# EAGLE design Serqet (EAGLE 6.6.0)

## Sheet 1 of 12: Probe Input
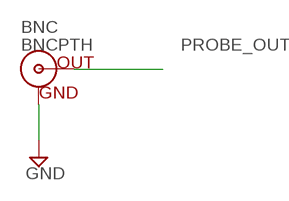
[diagram p0: schematic, sheet 1]

### Parts
BNC  BNCPTH  [BNC]

### Nets
GND: BNC.GND ; also sheet 2,3,4,5,6,7,8,9,10,11,12
PROBE_OUT: BNC.S(OUT) ; also sheet 2,3

## Sheet 2 of 12: Input Voltage Protection
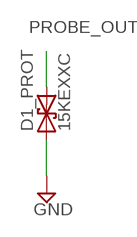
[diagram p1: schematic, sheet 2]

### Parts
D1_PROT  15KEXXC  [CB429-17]

### Nets
GND: D1_PROT.A ; also sheet 1,3,4,5,6,7,8,9,10,11,12
PROBE_OUT: D1_PROT.C ; also sheet 1,3

## Sheet 3 of 12: Attenuator
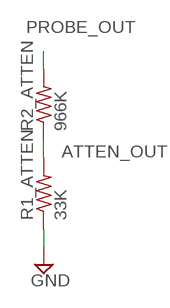
[diagram p2: schematic, sheet 3]

### Parts
R1_ATTEN  33K  R-US_R0603  [R0603]
R2_ATTEN  966K  R-US_R0603  [R0603]

### Nets
ATTEN_OUT: R1_ATTEN.2 R2_ATTEN.1 ; also sheet 4,8,11
GND: R1_ATTEN.1 ; also sheet 1,2,4,5,6,7,8,9,10,11,12
PROBE_OUT: R2_ATTEN.2 ; also sheet 1,2

## Sheet 4 of 12: DC Offset
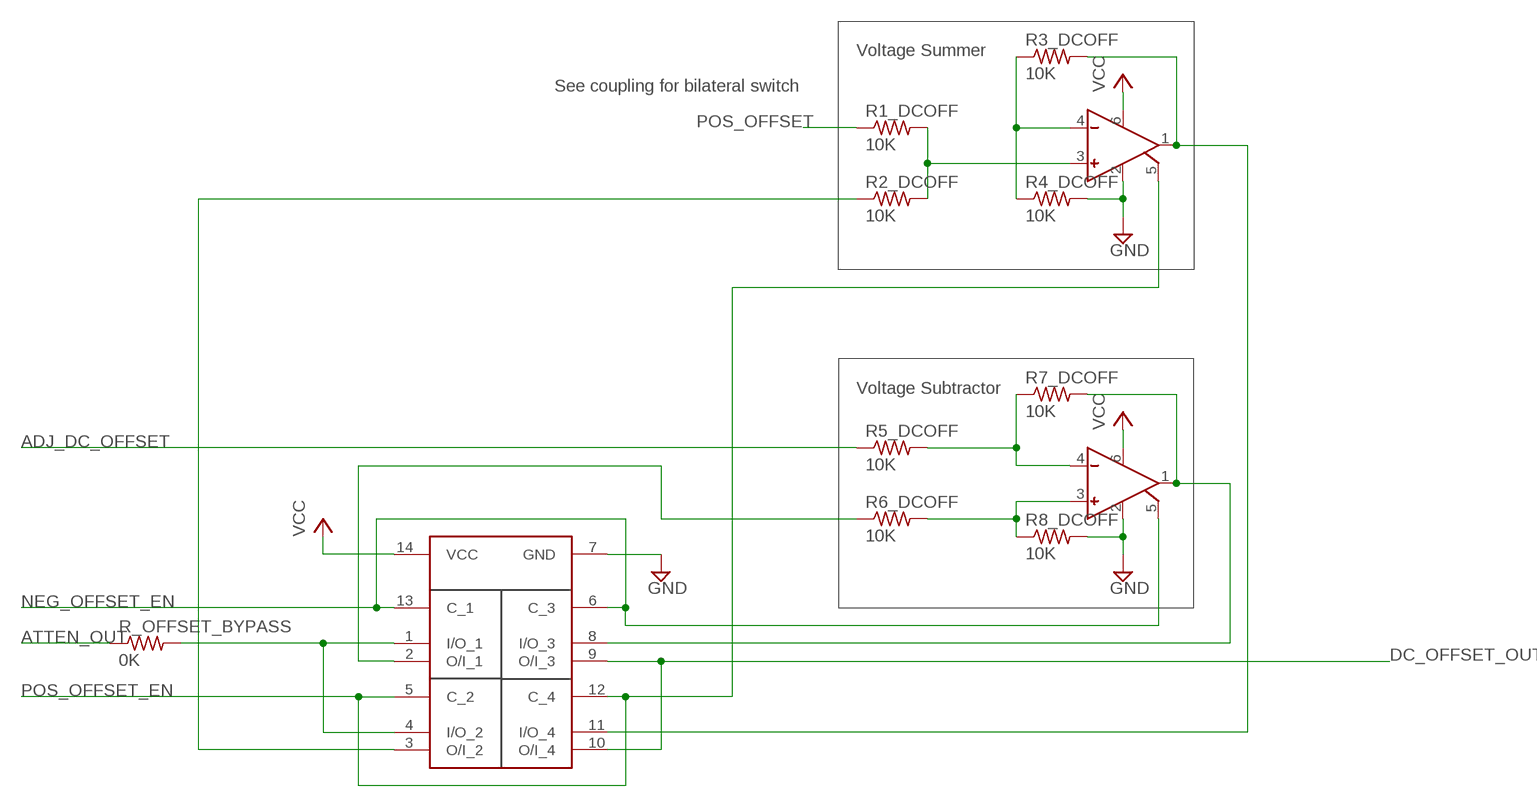
[diagram p3: schematic, sheet 4]

### Parts
BILATERAL_DCOFF  TC74HC4066AFT  [TSSOP14]
OP_AMP1_DCOFF  OPA355  [SOT23-6]
OP_AMP2_DCOFF  OPA355  [SOT23-6]
R1_DCOFF  10K  R-US_R0603  [R0603]
R2_DCOFF  10K  R-US_R0603  [R0603]
R3_DCOFF  10K  R-US_R0603  [R0603]
R4_DCOFF  10K  R-US_R0603  [R0603]
R5_DCOFF  10K  R-US_R0603  [R0603]
R6_DCOFF  10K  R-US_R0603  [R0603]
R7_DCOFF  10K  R-US_R0603  [R0603]
R8_DCOFF  10K  R-US_R0603  [R0603]
R_OFFSET_BYPASS  0K  R-US_R0603  [R0603]

### Nets
ADJ_DC_OFFSET: R5_DCOFF.1 ; also sheet 5,12
ATTEN_OUT: R_OFFSET_BYPASS.1 ; also sheet 3,8,11
DC_OFFSET_OUT: BILATERAL_DCOFF.9(O/I_3) BILATERAL_DCOFF.10(O/I_4) ; also sheet 5
GND: BILATERAL_DCOFF.7(GND) OP_AMP1_DCOFF.2(GND) OP_AMP2_DCOFF.2(GND) R4_DCOFF.2 R8_DCOFF.2 ; also sheet 1,2,3,5,6,7,8,9,10,11,12
N$12: OP_AMP1_DCOFF.4(V-) R3_DCOFF.1 R4_DCOFF.1
N$13: OP_AMP1_DCOFF.3(V+) R1_DCOFF.2 R2_DCOFF.2
N$14: BILATERAL_DCOFF.11(I/O_4) OP_AMP1_DCOFF.1(OUT) R3_DCOFF.2
N$15: OP_AMP2_DCOFF.3(V+) R6_DCOFF.2 R8_DCOFF.1
N$16: OP_AMP2_DCOFF.4(V-) R5_DCOFF.2 R7_DCOFF.1
N$17: BILATERAL_DCOFF.8(I/O_3) OP_AMP2_DCOFF.1(OUT) R7_DCOFF.2
N$19: BILATERAL_DCOFF.2(O/I_1) R6_DCOFF.1
N$22: BILATERAL_DCOFF.3(O/I_2) R2_DCOFF.1 ; also sheet 11
NEG_OFFSET_EN: BILATERAL_DCOFF.6(C_3) BILATERAL_DCOFF.13(C_1) OP_AMP2_DCOFF.5(ENABLE) ; also sheet 11
NET_IO_1: BILATERAL_DCOFF.1(I/O_1) BILATERAL_DCOFF.4(I/O_2) R_OFFSET_BYPASS.2
POS_OFFSET: R1_DCOFF.1 ; also sheet 5
POS_OFFSET_EN: BILATERAL_DCOFF.5(C_2) BILATERAL_DCOFF.12(C_4) OP_AMP1_DCOFF.5(ENABLE) ; also sheet 5,11
VCC: BILATERAL_DCOFF.14(VCC) OP_AMP1_DCOFF.6(VCC) OP_AMP2_DCOFF.6(VCC) ; also sheet 5,6,7,8,10,11,12

### Notes on the sheet
- Voltage Summer
- See coupling for bilateral switch
- Voltage Subtractor

## Sheet 5 of 12: Coupling
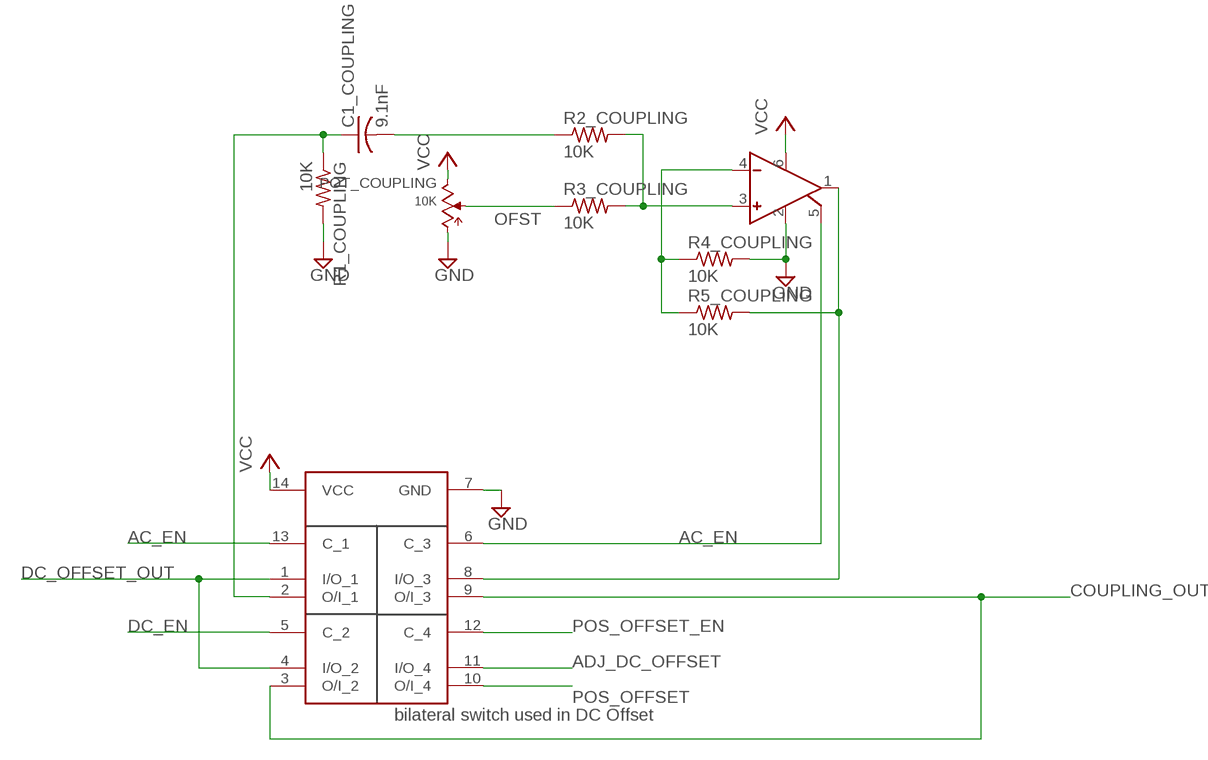
[diagram p4: schematic, sheet 5]

### Parts
BILATERAL_COUPLING  TC74HC4066AFT  [TSSOP14]
C1_COUPLING  9.1nF  C-USC0603  [C0603]
OP_AMP_COUPLING  OPA355  [SOT23-6]
POT_COUPLING  10K  POT-CHEAP_3HOLE_TRIM  [TRIMPOT:3HOLE_CHEAP]
R1_COUPLING  10K  R-US_R0603  [R0603]
R2_COUPLING  10K  R-US_R0603  [R0603]
R3_COUPLING  10K  R-US_R0603  [R0603]
R4_COUPLING  10K  R-US_R0603  [R0603]
R5_COUPLING  10K  R-US_R0603  [R0603]

### Nets
AC_COUPLING_IN: BILATERAL_COUPLING.2(O/I_1) C1_COUPLING.1 R1_COUPLING.1
AC_EN: BILATERAL_COUPLING.6(C_3) BILATERAL_COUPLING.13(C_1) OP_AMP_COUPLING.5(ENABLE) ; also sheet 11
ADJ_DC_OFFSET: BILATERAL_COUPLING.11(I/O_4) ; also sheet 4,12
COUPLING_OPAMP_OUT: BILATERAL_COUPLING.8(I/O_3) OP_AMP_COUPLING.1(OUT) R5_COUPLING.2
COUPLING_OUT: BILATERAL_COUPLING.3(O/I_2) BILATERAL_COUPLING.9(O/I_3) ; also sheet 6
DC_EN: BILATERAL_COUPLING.5(C_2) ; also sheet 11
DC_OFFSET_OUT: BILATERAL_COUPLING.1(I/O_1) BILATERAL_COUPLING.4(I/O_2) ; also sheet 4
GND: BILATERAL_COUPLING.7(GND) OP_AMP_COUPLING.2(GND) POT_COUPLING.CCW R1_COUPLING.2 R4_COUPLING.2 ; also sheet 1,2,3,4,6,7,8,9,10,11,12
N$7: OP_AMP_COUPLING.3(V+) R2_COUPLING.2 R3_COUPLING.2
N$9: OP_AMP_COUPLING.4(V-) R4_COUPLING.1 R5_COUPLING.1
N$10: C1_COUPLING.2 R2_COUPLING.1
OFST: POT_COUPLING.W R3_COUPLING.1
POS_OFFSET: BILATERAL_COUPLING.10(O/I_4) ; also sheet 4
POS_OFFSET_EN: BILATERAL_COUPLING.12(C_4) ; also sheet 4,11
VCC: BILATERAL_COUPLING.14(VCC) OP_AMP_COUPLING.6(VCC) POT_COUPLING.CW ; also sheet 4,6,7,8,10,11,12

### Notes on the sheet
- bilateral switch used in DC Offset

## Sheet 6 of 12: LPF
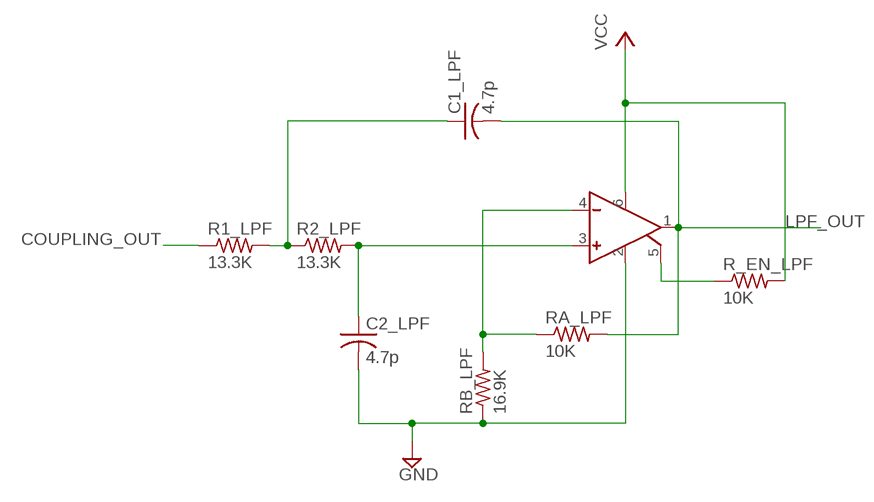
[diagram p5: schematic, sheet 6]

### Parts
C1_LPF  4.7p  C-USC0603  [C0603]
C2_LPF  4.7p  C-USC0603  [C0603]
OP_AMP_LPF  OPA355  [SOT23-6]
R1_LPF  13.3K  R-US_R0603  [R0603]
R2_LPF  13.3K  R-US_R0603  [R0603]
R_EN_LPF  10K  R-US_R0603  [R0603]
RA_LPF  10K  R-US_R0603  [R0603]
RB_LPF  16.9K  R-US_R0603  [R0603]

### Nets
COUPLING_OUT: R1_LPF.1 ; also sheet 5
GND: C2_LPF.2 OP_AMP_LPF.2(GND) RB_LPF.1 ; also sheet 1,2,3,4,5,7,8,9,10,11,12
LPF_OUT: C1_LPF.2 OP_AMP_LPF.1(OUT) RA_LPF.2 ; also sheet 7
N$2: C2_LPF.1 OP_AMP_LPF.3(V+) R2_LPF.2
N$4: C1_LPF.1 R1_LPF.2 R2_LPF.1
N$5: OP_AMP_LPF.4(V-) RA_LPF.1 RB_LPF.2
N$28: OP_AMP_LPF.5(ENABLE) R_EN_LPF.1
VCC: OP_AMP_LPF.6(VCC) R_EN_LPF.2 ; also sheet 4,5,7,8,10,11,12

## Sheet 7 of 12: VGA
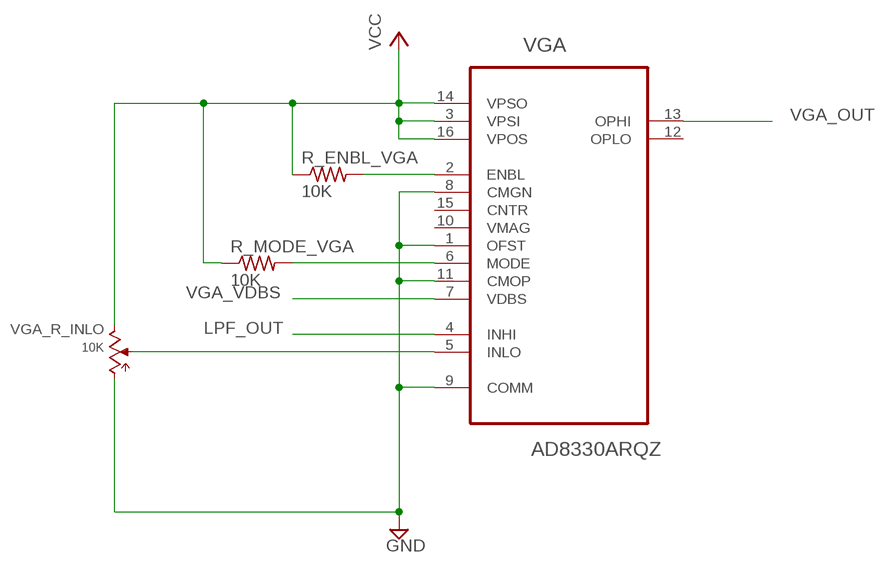
[diagram p6: schematic, sheet 7]

### Parts
R_ENBL_VGA  10K  R-US_R0603  [R0603]
R_MODE_VGA  10K  R-US_R0603  [R0603]
VGA  AD8330ARQZ  [SOP63P600X175-16N]
VGA_R_INLO  10K  POT-CHEAP_3HOLE_TRIM  [TRIMPOT:3HOLE_CHEAP]

### Nets
GND: VGA.1(OFST) VGA.8(CMGN) VGA.9(COMM) VGA.11(CMOP) VGA_R_INLO.CCW ; also sheet 1,2,3,4,5,6,8,9,10,11,12
LPF_OUT: VGA.4(INHI) ; also sheet 6
N$3: VGA.5(INLO) VGA_R_INLO.W
N$27: R_ENBL_VGA.2 VGA.2(ENBL)
VCC: R_ENBL_VGA.1 R_MODE_VGA.1 VGA.3(VPSI) VGA.14(VPSO) VGA.16(VPOS) VGA_R_INLO.CW ; also sheet 4,5,6,8,10,11,12
VGA_MODE: R_MODE_VGA.2 VGA.6(MODE)
VGA_OUT: VGA.13(OPHI) ; also sheet 8
VGA_VDBS: VGA.7(VDBS) ; also sheet 12
Unconnected: VGA.10(VMAG) VGA.12(OPLO) VGA.15(CNTR)

## Sheet 8 of 12: ADC
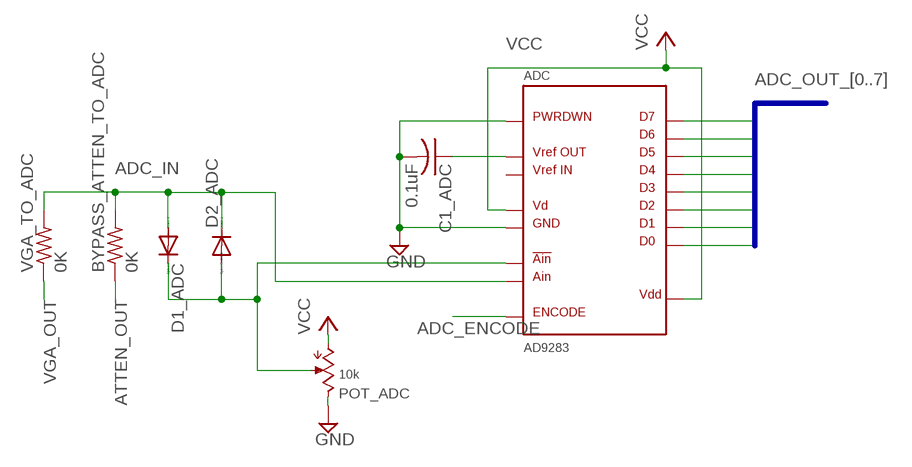
[diagram p7: schematic, sheet 8]

### Parts
ADC  AD9283  [SSOP20]
BYPASS_ATTEN_TO_ADC  0K  R-US_R0603  [R0603]
C1_ADC  0.1uF  C-USC0603  [C0603]
D1_ADC  1N4933  [DO41-10]
D2_ADC  1N4933  [DO41-10]
POT_ADC  10k  POT-CHEAP_3HOLE_TRIM  [TRIMPOT:3HOLE_CHEAP]
VGA_TO_ADC  0K  R-US_R0603  [R0603]

### Nets
ADC_ENCODE: ADC.10(ENCODE) ; also sheet 9
ADC_IN: ADC.7(AIN) BYPASS_ATTEN_TO_ADC.2 D1_ADC.A D2_ADC.C VGA_TO_ADC.2
ADC_OUT_0: ADC.20(D0) ; also sheet 9
ADC_OUT_1: ADC.19(D1) ; also sheet 9
ADC_OUT_2: ADC.18(D2) ; also sheet 9
ADC_OUT_3: ADC.17(D3) ; also sheet 9
ADC_OUT_4: ADC.14(D4) ; also sheet 9
ADC_OUT_5: ADC.13(D5) ; also sheet 9
ADC_OUT_6: ADC.12(D6) ; also sheet 9
ADC_OUT_7: ADC.11(D7) ; also sheet 9
ATTEN_OUT: BYPASS_ATTEN_TO_ADC.1 ; also sheet 3,4,11
GND: ADC.1(PWRDWN) ADC.4(GND) ADC.9(GND) ADC.16(GND) C1_ADC.2 POT_ADC.CW ; also sheet 1,2,3,4,5,6,7,9,10,11,12
N$6: ADC.2(VREFOUT) C1_ADC.1
N$8: ADC.6(!AIN) D1_ADC.C D2_ADC.A POT_ADC.W
VCC: ADC.5(VD) ADC.8(VD) ADC.15(VDD) POT_ADC.CCW ; also sheet 4,5,6,7,10,11,12
VGA_OUT: VGA_TO_ADC.1 ; also sheet 7

### Buses
ADC_OUT_[0..7]

## Sheet 9 of 12: FPGA
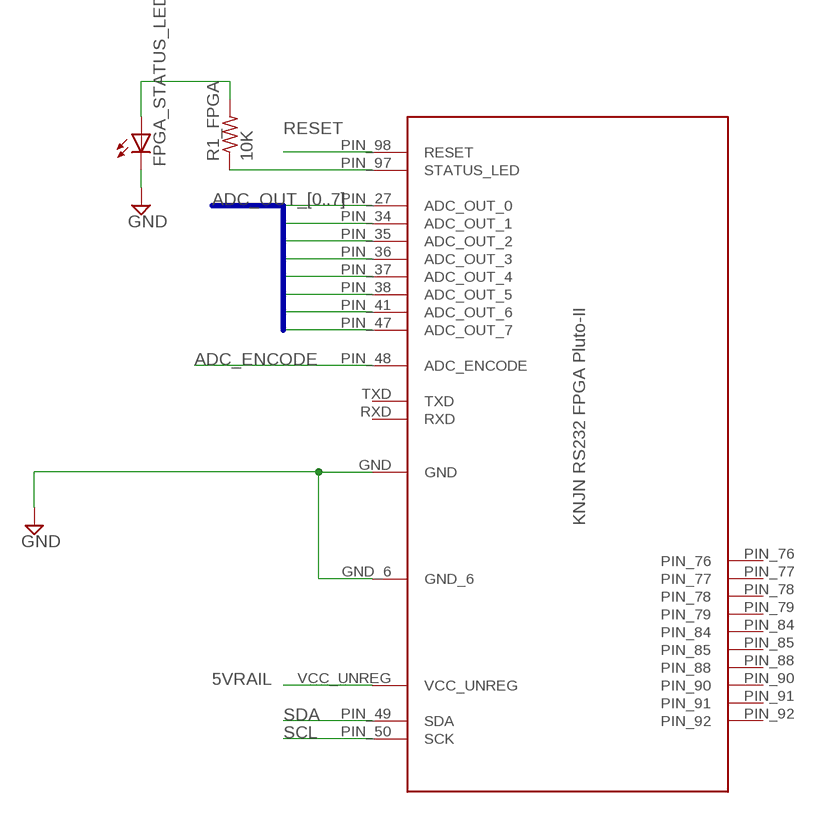
[diagram p8: schematic, sheet 9]

### Parts
FPGA  KNJNRS232FPGAPLUTO-IIKNJNRS232FPGAPLUTO-II  [KNJNRS232FPGAPLUTO-II]
FPGA_STATUS_LED  LEDCHIP-LED0805  [CHIP-LED0805]
R1_FPGA  10K  R-US_R0603  [R0603]

### Nets
5VRAIL: FPGA.VCC_UNREG ; also sheet 10
ADC_ENCODE: FPGA.PIN_48(ADC_ENCODE) ; also sheet 8
ADC_OUT_0: FPGA.PIN_47(ADC_OUT_7) ; also sheet 8
ADC_OUT_1: FPGA.PIN_41(ADC_OUT_6) ; also sheet 8
ADC_OUT_2: FPGA.PIN_38(ADC_OUT_5) ; also sheet 8
ADC_OUT_3: FPGA.PIN_37(ADC_OUT_4) ; also sheet 8
ADC_OUT_4: FPGA.PIN_36(ADC_OUT_3) ; also sheet 8
ADC_OUT_5: FPGA.PIN_35(ADC_OUT_2) ; also sheet 8
ADC_OUT_6: FPGA.PIN_34(ADC_OUT_1) ; also sheet 8
ADC_OUT_7: FPGA.PIN_27(ADC_OUT_0) ; also sheet 8
GND: FPGA.GND FPGA.GND_6 FPGA_STATUS_LED.C ; also sheet 1,2,3,4,5,6,7,8,10,11,12
N$11: FPGA.PIN_97(STATUS_LED) R1_FPGA.1
N$18: FPGA_STATUS_LED.A R1_FPGA.2
RESET: FPGA.PIN_98(RESET) ; also sheet 11
SCL: FPGA.PIN_50(SCK) ; also sheet 11,12
SDA: FPGA.PIN_49(SDA) ; also sheet 11,12
Unconnected: FPGA.PIN_76 FPGA.PIN_77 FPGA.PIN_78 FPGA.PIN_79 FPGA.PIN_84 FPGA.PIN_85 FPGA.PIN_88 FPGA.PIN_90 FPGA.PIN_91 FPGA.PIN_92 FPGA.RXD FPGA.TXD

### Buses
ADC_OUT_[0..7]

## Sheet 10 of 12: Power Controller
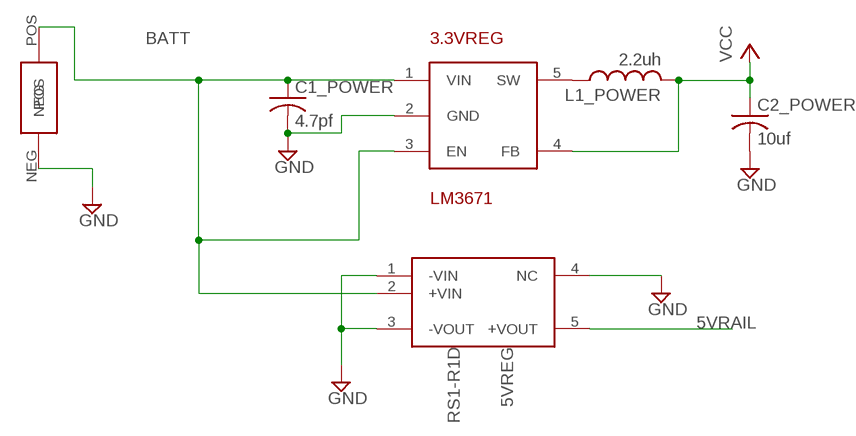
[diagram p9: schematic, sheet 10]

### Parts
3.3VREG  LM3671  [SOT23-5]
5VREG  RS1-R1D  [8-SMD]
BATTERY  LED_THROUGHHOLE  [LED_THROUGHHOLE]
C1_POWER  4.7pf  C-USC0603  [C0603]
C2_POWER  10uf  C-USC0603  [C0603]
L1_POWER  2.2uh  L-USL1008  [L1812]

### Nets
5VRAIL: 5VREG.5(+VOUT) ; also sheet 9
BATT: 3.3VREG.1(VIN) 3.3VREG.3(EN) 5VREG.2(+VIN) BATTERY.POS C1_POWER.1
GND: 3.3VREG.2(GND) 5VREG.1(-VIN) 5VREG.3(-VOUT) 5VREG.4(NC) BATTERY.NEG C1_POWER.2 C2_POWER.2 ; also sheet 1,2,3,4,5,6,7,8,9,11,12
N$1: 3.3VREG.5(SW) L1_POWER.1
VCC: 3.3VREG.4(FB) C2_POWER.1 L1_POWER.2 ; also sheet 4,5,6,7,8,11,12

## Sheet 11 of 12: Micro/Bluetooth
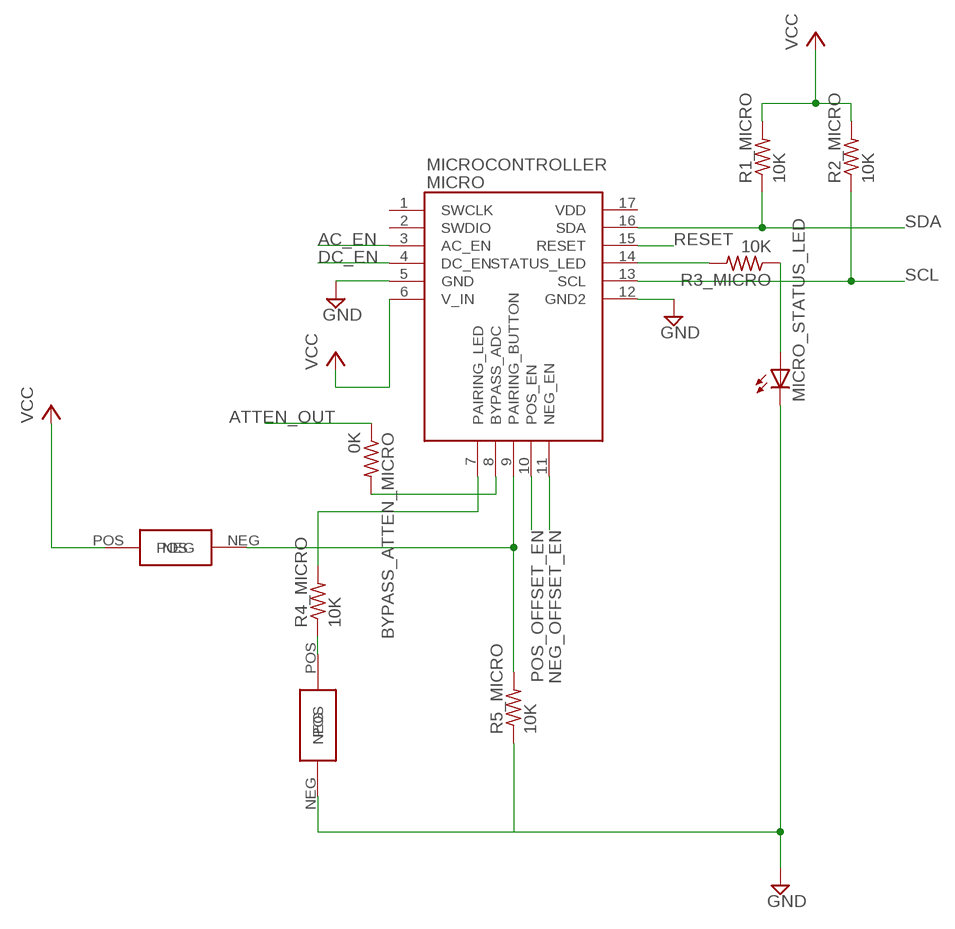
[diagram p10: schematic, sheet 11]

### Parts
BYPASS_ATTEN_MICRO  0K  R-US_R0603  [R0603]
LED_THROUGHOLE  LED_THROUGHHOLE  [LED_THROUGHHOLE]
MICRO  MICROCONTROLLER  [MICROPROC]
MICRO_STATUS_LED  LEDCHIP-LED0805  [CHIP-LED0805]
PAIRING_SWITCH  LED_THROUGHHOLE  [LED_THROUGHHOLE]
R1_MICRO  10K  R-US_R0603  [R0603]
R2_MICRO  10K  R-US_R0603  [R0603]
R3_MICRO  10K  R-US_R0603  [R0603]
R4_MICRO  10K  R-US_R0603  [R0603]
R5_MICRO  10K  R-US_R0603  [R0603]

### Nets
AC_EN: MICRO.3(AC_EN) ; also sheet 5
ATTEN_OUT: BYPASS_ATTEN_MICRO.1 ; also sheet 3,4,8
DC_EN: MICRO.4(DC_EN) ; also sheet 5
GND: LED_THROUGHOLE.NEG MICRO.5(GND) MICRO.12(GND2) MICRO_STATUS_LED.C R5_MICRO.1 ; also sheet 1,2,3,4,5,6,7,8,9,10,12
N$20: MICRO.14(STATUS_LED) R3_MICRO.2
N$21: MICRO_STATUS_LED.A R3_MICRO.1
N$22: MICRO.9(PAIRING_BUTTON) PAIRING_SWITCH.NEG R5_MICRO.2 ; also sheet 4
N$23: MICRO.7(PAIRING_LED) R4_MICRO.2
N$24: LED_THROUGHOLE.POS R4_MICRO.1
N$26: BYPASS_ATTEN_MICRO.2 MICRO.8(BYPASS_ADC)
NEG_OFFSET_EN: MICRO.11(NEG_EN) ; also sheet 4
POS_OFFSET_EN: MICRO.10(POS_EN) ; also sheet 4,5
RESET: MICRO.15(RESET) ; also sheet 9
SCL: MICRO.13(SCL) R2_MICRO.1 ; also sheet 9,12
SDA: MICRO.16(SDA) R1_MICRO.1 ; also sheet 9,12
VCC: MICRO.6(V_IN) PAIRING_SWITCH.POS R1_MICRO.2 R2_MICRO.2 ; also sheet 4,5,6,7,8,10,12
Unconnected: MICRO.1(SWCLK) MICRO.2(SWDIO) MICRO.17(VDD)

## Sheet 12 of 12: I2C DAC
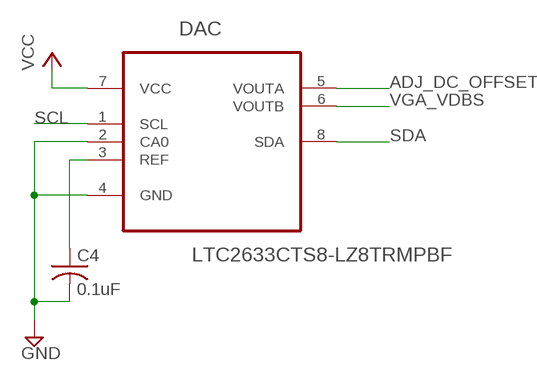
[diagram p11: schematic, sheet 12]

### Parts
C4  0.1uF  C-USC0603  [C0603]
DAC  LTC2633CTS8-LZ8TRMPBF  [SOT65P280X100-8N]

### Nets
ADJ_DC_OFFSET: DAC.5(VOUTA) ; also sheet 4,5
GND: C4.2 DAC.2(CA0) DAC.4(GND) ; also sheet 1,2,3,4,5,6,7,8,9,10,11
N$25: C4.1 DAC.3(REF)
SCL: DAC.1(SCL) ; also sheet 9,11
SDA: DAC.8(SDA) ; also sheet 9,11
VCC: DAC.7(VCC) ; also sheet 4,5,6,7,8,10,11
VGA_VDBS: DAC.6(VOUTB) ; also sheet 7

## Power pins joined to a net without a drawn wire
VREFIN: ADC.3(VREFIN)

## Library data of the parts
3.3VREG = texas-custom:LM3671: Texas Instruments LM3671, LM3671Q 2MHz, 600mA Step-Down DC-DC Converter
5VREG = DCDCboost:RS1-R1D
ADC = CARA:AD9283: Analog Devices 8 bit ADC with Single/Differential input and 50/80/100 Msps.
BATTERY LED_THROUGHOLE PAIRING_SWITCH = con-custom:LED_THROUGHHOLE
BILATERAL_COUPLING BILATERAL_DCOFF = SparkFun-DigitalIC:TC74HC4066AFT: TC74HC4066AFT
BNC = SparkFun-Connectors:BNC: BNC Connector, Mouser Part# 5227161
BYPASS_ATTEN_MICRO BYPASS_ATTEN_TO_ADC R1_ATTEN R1_FPGA R1_MICRO R2_ATTEN R2_MICRO R3_MICRO R4_MICRO VGA_TO_ADC = resistor:R-US_: RESISTOR, American symbol
C1_ADC C1_COUPLING C1_LPF C1_POWER C2_LPF C2_POWER C4 = rcl:C-US: CAPACITOR, American symbol
D1_ADC D2_ADC = diode:1N4933: DIODE fast recovery rectifier, 1A
D1_PROT = diode:15KEXXC: DIODE
DAC = LTC_By_element14_Batch_1:LTC2633CTS8-LZ8TRMPBF: DAC; MPN: LTC2633CTS8-LZ8#TRMPBF; OC_FARNELL: -; OC_NEWARK: 48T3867; PACKAGE: SOT-8; SUPPLIER: Linear Technology
FPGA = KNJN_RS232_FPGA_Pluto-II:KNJNRS232FPGAPLUTO-II
FPGA_STATUS_LED MICRO_STATUS_LED = led:LED: LED OSRAM: - CHIPLED LG R971, LG N971, LY N971, LG Q971, LY Q971, LO R971, LY R971 LH N974, LH R974 LS Q976, LO Q976, LY Q976 LO Q996 - Hyper CHIPLED LW Q18S LB Q993, LB Q99A, LB R99A - SideLED LS A670, LO A670, LY A670, LG A670, LP A670 LB A673, LV A673, LT A673, LW A673 LH A674 LY A675 LS A676, LA A676, LO A676, LY A676, LW A676 LS A679, LY A679, LG A679 - Hyper Micro SIDELED® LS Y876, LA Y876, LO Y876, LY Y876 LT Y87S - SmartLED LW L88C, LW L88S LB L89C, LB L89S, LG L890 LS L89K, LO L89K, LY L89K LS L896, LA L896, LO L896, LY L896 - TOPLED LS T670, LO T670, LY T670, LG T670, LP T670 LSG T670, LSP T670, LSY T670, LOP T670, LYG T670 LG T671, LOG T671, LSG T671 LB T673, LV T673, LT T673, LW T673 LH T674 LS T676, LA T676, LO T676, LY T676, LB T676, LH T676, LSB T676, LW T676 LB T67C, LV T67C, LT T67C, LS T67K, LO T67K, LY T67K, LW E67C LS E67B, LA E67B, LO E67B, LY E67B, LB E67C, LV E67C, LT E67C LW T67C LS T679, LY T679, LG T679 LS T770, LO T770, LY T770, LG T770, LP T770 LB T773, LV T773, LT T773, LW T773 LH T774 LS E675, LA E675, LY E675, LS T675 LS T776, LA T776, LO T776, LY T776, LB T776 LHGB T686 LT T68C, LB T68C - Hyper Mini TOPLED® LB M676 - Mini TOPLED Santana® LG M470 LS M47K, LO M47K, LY M47K Source: http://www.osram.convergy.de LUXEON: - LUMILED® LXK2-PW12-R00, LXK2-PW12-S00, LXK2-PW14-U00, LXK2-PW14-V00 LXK2-PM12-R00, LXK2-PM12-S00, LXK2-PM14-U00 LXK2-PE12-Q00, LXK2-PE12-R00, LXK2-PE12-S00, LXK2-PE14-T00, LXK2-PE14-U00 LXK2-PB12-K00, LXK2-PB12-L00, LXK2-PB12-M00, LXK2-PB14-N00, LXK2-PB14-P00, LXK2-PB14-Q00 LXK2-PR12-L00, LXK2-PR12-M00, LXK2-PR14-Q00, LXK2-PR14-R00 LXK2-PD12-Q00, LXK2-PD12-R00, LXK2-PD12-S00 LXK2-PH12-R00, LXK2-PH12-S00 LXK2-PL12-P00, LXK2-PL12-Q00, LXK2-PL12-R00 Source: www.luxeon.com KINGBRIGHT: KA-3528ASYC Source: www.kingbright.com
L1_POWER = rcl edit:L-US: INDUCTOR, American symbol
MICRO = Microprocessor:MICROCONTROLLER
OP_AMP1_DCOFF OP_AMP2_DCOFF OP_AMP_COUPLING OP_AMP_LPF = 25AA02E48:OPA355
POT_ADC POT_COUPLING VGA_R_INLO = QuantumOptics:POT: Pot, regular or trimpot
R1_COUPLING R1_DCOFF R1_LPF R2_COUPLING R2_DCOFF R2_LPF R3_COUPLING R3_DCOFF R4_COUPLING R4_DCOFF R5_COUPLING R5_DCOFF R5_MICRO R6_DCOFF R7_DCOFF R8_DCOFF R_EN_LPF R_ENBL_VGA R_MODE_VGA R_OFFSET_BYPASS RA_LPF RB_LPF = rcl:R-US_: RESISTOR, American symbol
VGA = AD8330ARQZ-R7:AD8330ARQZ: Variable Gain Amplifier; MPN: AD8330ARQZ; OC_FARNELL: 9994491; OC_NEWARK: 19M1199; PACKAGE: QSOP-16; SUPPLIER: ANALOG DEVICES

## Board
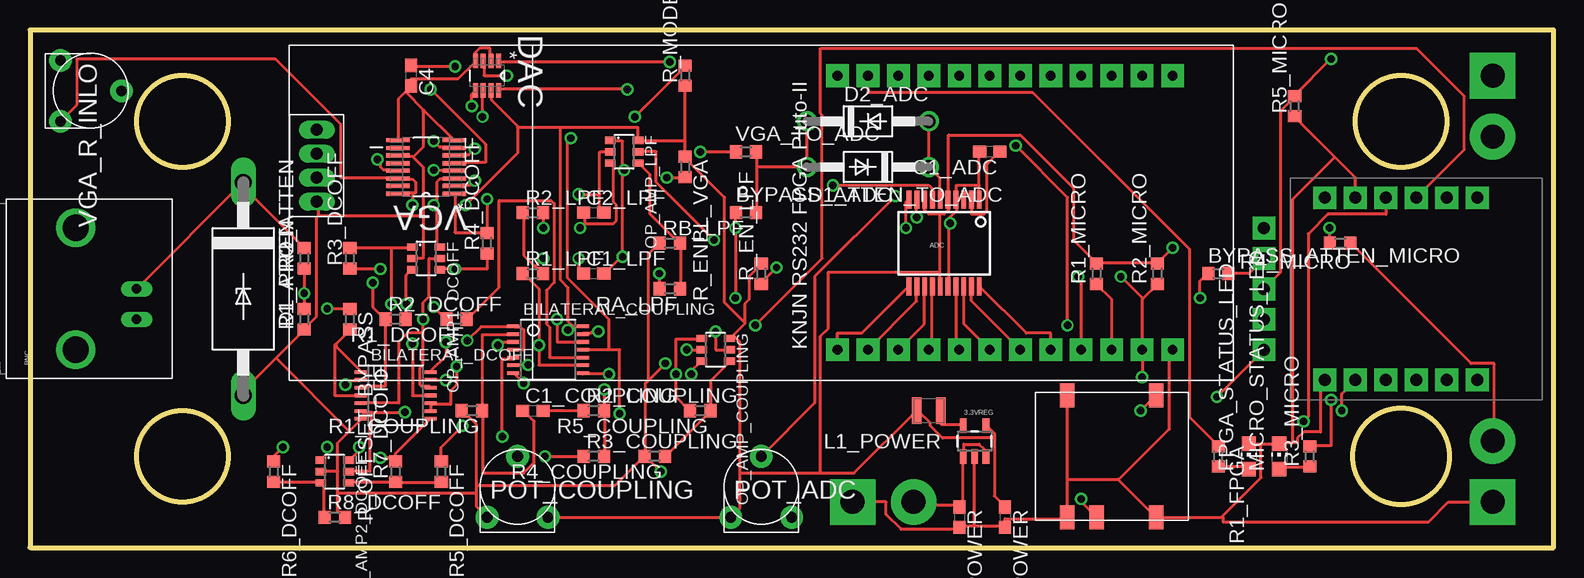
[diagram p12: board, top side]
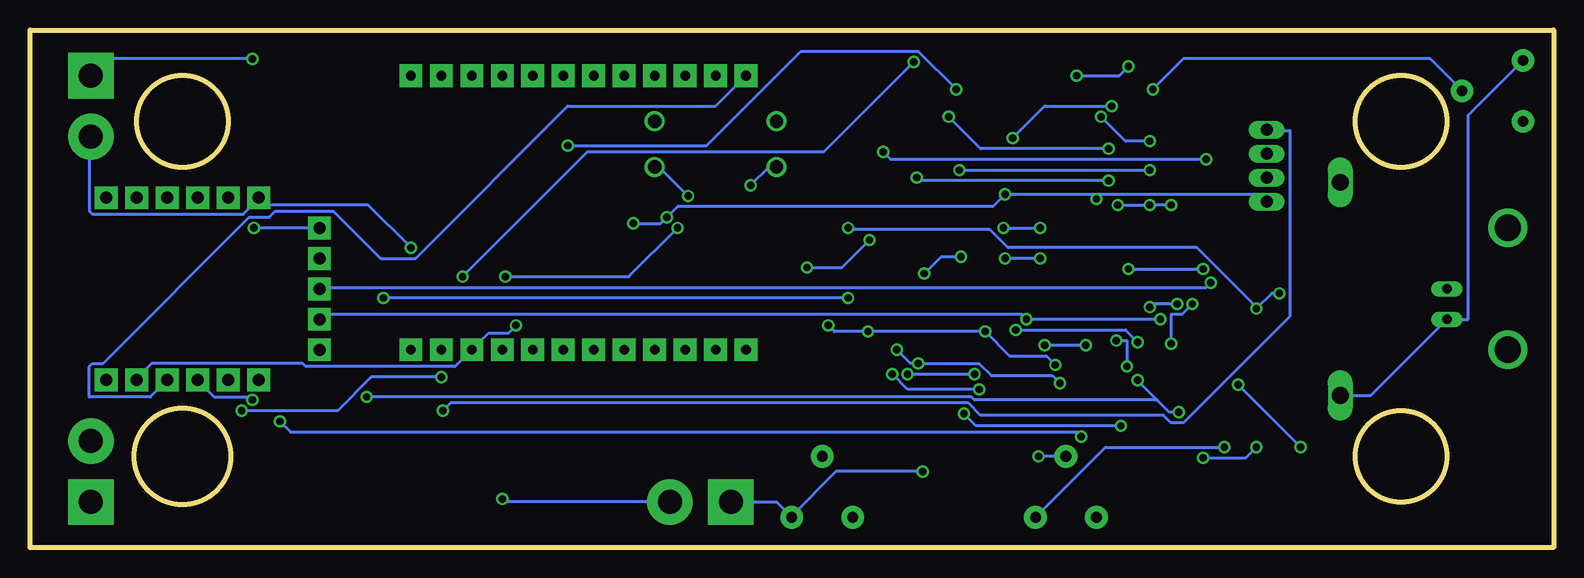
[diagram p13: board, bottom side, seen from below]

Size 127 x 43.18 mm. Coordinates in mm from the lower left corner, seen from the top.
Outline: 0,0 127,0 127,43.18 0,43.18 0,0
Outline: circle at 12.7,7.62 radius 3.81
Outline: circle at 12.7,35.56 radius 3.81
Outline: circle at 114.3,7.62 radius 4.02
Outline: circle at 114.3,35.56 radius 3.81
Copper layers (1*16): Top 0.035mm / dielectric 1.5mm / Bottom 0.035mm
Design rules "default *": minimum track width 10mil, minimum drill 24mil, track to track 8mil, track to pad 10mil, pad to pad 8mil, via to via 8mil, smd to smd 8mil, copper to edge 40mil, drill to drill 8mil, minimum pad ring 10mil, minimum via ring 8mil, stop-mask expansion 4mil, vias tented up to drill 0mil, thermal gap 10mil

### Footprints (pad centres in the part's own frame; a part is rotated, then mirrored left to right if it is on the bottom)
SOT23-5 = smd 0.55 x 1.2: 1 -0.95,-1.3; 2 0,-1.3; 3 0.95,-1.3; 4 0.95,1.3; 5 -0.95,1.3
8-SMD = smd 1.2 x 2: 1 -3.72,-5.1; 2 -1.27,-5.1; 3 3.72,-5.1; 4 -3.72,5.1; 5 3.72,5.1
SSOP20 = smd 0.4 x 1.5: 1 -2.925,-3.625; 2 -2.275,-3.625; 3 -1.625,-3.625; 4 -0.975,-3.625; 5 -0.325,-3.625; 6 0.325,-3.625; 7 0.975,-3.625; 8 1.625,-3.625; 9 2.275,-3.625; 10 2.925,-3.625; 11 2.925,3.625; 12 2.275,3.625; 13 1.625,3.625; 14 0.975,3.625; 15 0.325,3.625; 16 -0.325,3.625; 17 -0.975,3.625; 18 -1.625,3.625; 19 -2.275,3.625; 20 -2.925,3.625
LED_THROUGHHOLE = drill 2 pad 3.81 square: NEG -2.54,0 | drill 2 pad 3.81: POS 2.54,0
TSSOP14 = smd 0.305 x 0.991: 1 -1.95,-2.918; 2 -1.3,-2.918; 3 -0.65,-2.918; 4 0,-2.918; 5 0.65,-2.918; 6 1.3,-2.918; 7 1.95,-2.918; 8 1.95,2.918; 9 1.3,2.918; 10 0.65,2.918; 11 0,2.918; 12 -0.65,2.918; 13 -1.3,2.918; 14 -1.95,2.918
BNC = drill 2.2: 3 -5.08,5.08; 4 5.08,5.08 | drill 0.8 long: GND -2.54,0; S 0,0
R0603 = smd 1 x 1.1: 1 -0.85,0; 2 0.85,0
C0603 = smd 1.1 x 1: 1 -0.85,0; 2 0.85,0
DO41-10 = drill 1.118: A 5.08,0; C -5.08,0
CB429-17 = drill 1.397 long: A 8.89,0; C -8.89,0
SOT65P280X100-8N = smd 1.219 x 0.406: 1 -1.219,0.965; 2 -1.219,0.33; 3 -1.219,-0.33; 4 -1.219,-0.965; 5 1.219,-0.965; 6 1.219,-0.33; 7 1.219,0.33; 8 1.219,0.965
KNJNRS232FPGAPLUTO-II = drill 0.8 pad 1.905 square: GND -6.35,-6.35; PIN_27 -6.35,21.59; PIN_34 -6.35,19.05; PIN_35 -6.35,16.51; PIN_36 -6.35,13.97; PIN_37 -6.35,11.43; PIN_38 -6.35,8.89; PIN_41 -6.35,6.35; PIN_47 -6.35,3.81; PIN_48 -6.35,1.27; PIN_49 -6.35,-1.27; PIN_50 -6.35,-3.81; PIN_76 16.51,-6.35; PIN_77 16.51,-3.81; PIN_78 16.51,-1.27; PIN_79 16.51,1.27; PIN_84 16.51,3.81; PIN_85 16.51,6.35; PIN_88 16.51,8.89; PIN_90 16.51,11.43; PIN_91 16.51,13.97; PIN_92 16.51,16.51; PIN_97 16.51,19.05; PIN_98 16.51,21.59 | drill 1 pad 1.4 long: GND_6 6,65; RXD 10,65; TXD 8,65; VCC_UNREG 12,65
CHIP-LED0805 = smd 1.2 x 1.2: A 0,-1.05; C 0,1.05
L1812 = smd 0.8 x 2.2: 1 -1,0; 2 1,0
MICROPROC = drill 1 pad 1.905 square: 1 -7.593,5.08; 2 -7.593,2.54; 3 -7.593,0; 4 -7.593,-2.54; 5 -7.593,-5.08; 6 -7.593,-7.62; 7 -5.08,-12.7; 8 -2.54,-12.7; 9 0,-12.7; 10 2.54,-12.7; 11 5.08,-12.7; 12 7.593,-7.62; 13 7.593,-5.08; 14 7.593,-2.54; 15 7.593,0; 16 7.593,2.54; 17 7.593,5.08
SOT23-6 = smd 0.6 x 0.9: 1 -0.95,-1.15; 2 0,-1.15; 3 0.95,-1.15; 4 0.95,1.15; 5 0,1.15; 6 -0.95,1.15
TRIMPOT:3HOLE_CHEAP = drill 0.889 pad 1.905: CCW -2.54,-2.54; CW 2.54,-2.54; W 0,2.54
SOP63P600X175-16N = smd 1.981 x 0.356: 1 -2.362,2.235; 2 -2.362,1.575; 3 -2.362,0.965; 4 -2.362,0.305; 5 -2.362,-0.305; 6 -2.362,-0.965; 7 -2.362,-1.575; 8 -2.362,-2.235; 9 2.362,-2.235; 10 2.362,-1.575; 11 2.362,-0.965; 12 2.362,-0.305; 13 2.362,0.305; 14 2.362,0.965; 15 2.362,1.575; 16 2.362,2.235

### Placement (x,y rotation side)
3.3VREG  78.74,8.89 0 top
5VREG  90.17,7.62 0 top
ADC  76.2,25.4 180 top
BATTERY  71.12,3.81 0 top
BILATERAL_COUPLING  43.18,16.51 270 top
BILATERAL_DCOFF  30.48,12.7 270 top
BNC  8.89,21.59 90 top
BYPASS_ATTEN_MICRO  99.06,22.86 0 top
BYPASS_ATTEN_TO_ADC  59.69,27.94 0 top
C1_ADC  80.01,33.02 180 top
C1_COUPLING  41.91,11.43 0 top
C1_LPF  46.99,22.86 0 top
C1_POWER  77.47,2.54 270 top
C2_LPF  46.99,27.94 0 top
C2_POWER  81.28,2.54 270 top
C4  31.75,39.37 270 top
D1_ADC  69.85,31.75 180 top
D1_PROT  17.78,21.59 270 top
D2_ADC  69.85,35.56 0 top
DAC  38.1,39.37 270 top
FPGA  88.9,22.86 90 top
FPGA_STATUS_LED  101.6,7.62 0 top
L1_POWER  74.93,11.43 180 top
LED_THROUGHOLE  121.92,6.35 90 top
MICRO  115.57,21.59 270 top
MICRO_STATUS_LED  104.14,7.62 0 top
OP_AMP1_DCOFF  33.02,24.13 270 top
OP_AMP2_DCOFF  25.4,6.35 270 top
OP_AMP_COUPLING  57.15,16.51 270 top
OP_AMP_LPF  49.53,33.02 270 top
PAIRING_SWITCH  121.92,36.83 270 top
POT_ADC  60.96,5.08 0 top
POT_COUPLING  40.64,5.08 0 top
R1_ATTEN  22.86,19.05 90 top
R1_COUPLING  36.83,11.43 180 top
R1_DCOFF  35.56,19.05 180 top
R1_FPGA  99.06,7.62 270 top
R1_LPF  41.91,22.86 0 top
R1_MICRO  88.9,22.86 90 top
R2_ATTEN  22.86,24.13 90 top
R2_COUPLING  46.99,11.43 0 top
R2_DCOFF  30.48,19.05 0 top
R2_LPF  41.91,27.94 0 top
R2_MICRO  93.98,22.86 90 top
R3_COUPLING  46.99,7.62 0 top
R3_DCOFF  26.67,24.13 90 top
R3_MICRO  106.68,7.62 90 top
R4_COUPLING  52.07,7.62 180 top
R4_DCOFF  38.1,25.4 90 top
R4_MICRO  109.22,25.4 180 top
R5_COUPLING  55.88,11.43 180 top
R5_DCOFF  34.29,6.35 270 top
R5_MICRO  105.41,36.83 90 top
R6_DCOFF  20.32,6.35 270 top
R7_DCOFF  30.48,6.35 90 top
R8_DCOFF  25.4,2.54 0 top
R_EN_LPF  60.96,22.86 90 top
R_ENBL_VGA  54.61,31.75 270 top
R_MODE_VGA  54.61,39.37 90 top
R_OFFSET_BYPASS  26.67,19.05 270 top
RA_LPF  53.34,21.59 180 top
RB_LPF  53.34,25.4 0 top
VGA  33.02,31.75 180 top
VGA_R_INLO  5.08,38.1 270 top
VGA_TO_ADC  59.69,33.02 0 top

### Tracks (layer width: path | path; a pad name or v marks a point on that pad's centre or on a via)
5VRAIL  (via drill 0.61)
  Top 0.254: v92.58,11.43 93.85,12.7 5VREG.5
  Bottom 0.254: v92.58,11.43 91.95,12.06 48.77,12.06 47.75,11.05 32.51,11.05 31.88,10.41 30.86,10.41 21.97,19.3 21.97,34.8 23.88,34.8 FPGA.VCC_UNREG
AC_COUPLING_IN
  Top 0.254: 37.72,11.43 37.72,17.78 40.26,17.78 BILATERAL_COUPLING.2 | 37.72,11.43 37.72,6.22 41.15,6.22 42.04,7.11 42.04,10.54 41.15,11.43 C1_COUPLING.1 | 37.72,11.43 R1_COUPLING.1
AC_EN  (via drill 0.61)
  Top 0.254: OP_AMP_COUPLING.5 57.15,16.51 v57.15,18.03 | v47.37,18.03 46.86,18.03 46.74,17.91 46.1,17.91 BILATERAL_COUPLING.13 | v41.53,15.24 40.39,15.24 BILATERAL_COUPLING.6 | v60.45,18.54 66.04,24.13 66.04,36.07 65.91,36.2 65.91,41.66 115.57,41.66 119.51,37.72 119.51,33.15 115.57,29.21 MICRO.3
  Bottom 0.254: v41.53,15.24 42.29,16 45.34,16 v47.37,18.03 v57.15,18.03 59.94,18.03 v60.45,18.54
ADC_ENCODE  (via drill 0.61)
  Top 0.254: v73.03,26.67 73.03,28.83 73.15,28.96 ADC.10 | v87.38,22.61 87.63,22.35 FPGA.PIN_48
  Bottom 0.254: v73.03,26.67 77.09,22.61 v87.38,22.61
ADC_IN  (via drill 0.61)
  Top 0.254: 60.58,31.75 60.58,33.02 VGA_TO_ADC.2 | 60.58,31.75 60.58,27.94 BYPASS_ATTEN_TO_ADC.2 | v66.93,30.23 74.93,30.23 75.18,29.97 75.18,29.08 ADC.7 | 60.58,31.75 D1_ADC.A D2_ADC.C
  Bottom 0.254: v66.93,30.23 65.41,31.75 D1_ADC.A
ADC_OUT_0
  Top 0.254: FPGA.PIN_47 85.09,17.91 83.06,17.91 79.25,21.72 ADC.20
ADC_OUT_1
  Top 0.254: FPGA.PIN_41 78.49,20.57 78.49,21.72 ADC.19
ADC_OUT_2
  Top 0.254: FPGA.PIN_38 77.85,18.67 77.85,21.72 ADC.18
ADC_OUT_3
  Top 0.254: FPGA.PIN_37 77.22,16.76 77.22,21.72 ADC.17
ADC_OUT_4
  Top 0.254: FPGA.PIN_36 75.18,16.76 75.18,21.72 ADC.14
ADC_OUT_5
  Top 0.254: FPGA.PIN_35 74.55,18.67 74.55,21.72 ADC.13
ADC_OUT_6
  Top 0.254: FPGA.PIN_34 73.91,20.57 73.91,21.72 ADC.12
ADC_OUT_7
  Top 0.254: FPGA.PIN_27 67.31,17.91 69.34,17.91 73.15,21.72 ADC.11
ADJ_DC_OFFSET  (via drill 0.61)
  Top 0.254: 48.26,16.51 49.15,16.51 v49.15,11.18 | 48.26,16.51 BILATERAL_COUPLING.11 | v36.07,10.16 34.29,8.38 R5_DCOFF.1 | DAC.5 36.83,37.85 v36.83,36.83 | v45.09,34.16 44.83,33.91 44.83,22.48 48.26,19.05 48.26,16.51
  Bottom 0.254: v49.15,11.18 48.13,10.16 v36.07,10.16 | v36.83,36.83 42.42,36.83 v45.09,34.16
ATTEN_OUT  (via drill 0.61)
  Top 0.254: R2_ATTEN.1 v22.86,21.21 R1_ATTEN.2 | v24.77,19.94 26.67,19.94 R_OFFSET_BYPASS.1 | BYPASS_ATTEN_TO_ADC.1 58.8,27.94 v58.8,26.67 v58.8,20.83 | v97.54,20.83 97.54,22.23 98.17,22.86 BYPASS_ATTEN_MICRO.1
  Bottom 0.254: v22.86,21.21 23.5,21.21 v24.77,19.94 24.77,20.07 29.72,25.02 45.47,25.02 46.99,26.54 58.67,26.54 v58.8,26.67 | v58.8,20.83 v97.54,20.83
BATT  (via drill 0.61)
  Top 0.254: 3.3VREG.3 79.63,7.62 79.5,7.75 79.5,8.26 79.12,8.64 77.85,8.64 77.85,7.62 3.3VREG.1 77.72,7.49 77.72,3.68 77.47,3.43 C1_POWER.1 77.47,3.56 73.66,3.56 BATTERY.POS | v87.63,4.06 87.63,3.81 88.9,2.54 5VREG.2
  Bottom 0.254: v87.63,4.06 87.38,3.81 BATTERY.POS
COUPLING_OPAMP_OUT  (via drill 0.61)
  Top 0.254: OP_AMP_COUPLING.1 55.88,17.4 53.85,17.4 v53.85,14.48 53.85,12.57 54.99,11.43 R5_COUPLING.2 | v48.26,14.48 46.1,14.48 BILATERAL_COUPLING.8
  Bottom 0.254: v53.85,14.48 v48.26,14.48
COUPLING_OUT  (via drill 0.61)
  Top 0.254: BILATERAL_COUPLING.9 45.97,15.24 42.42,15.24 v42.42,16.89 42.42,21.59 41.15,22.86 R1_LPF.1 | v38.99,16.89 38.99,17.14 40.26,17.14 BILATERAL_COUPLING.3
  Bottom 0.254: v42.42,16.89 v38.99,16.89
DC_EN  (via drill 0.61)
  Top 0.254: v39.37,9.27 39.37,15.75 40.26,15.75 BILATERAL_COUPLING.5 | v106.17,10.54 106.55,10.92 106.55,26.16 108.2,27.81 113.03,27.81 MICRO.4
  Bottom 0.254: v39.37,9.27 39.75,9.65 105.28,9.65 v106.17,10.54
DC_OFFSET_OUT  (via drill 0.61)
  Top 0.254: BILATERAL_DCOFF.9 33.4,11.43 33.4,11.94 BILATERAL_DCOFF.10 33.53,11.94 35.05,11.94 35.05,13.08 35.56,13.59 v35.56,15.11 | BILATERAL_COUPLING.4 41.15,16.51 41.15,18.16 40.89,18.41 40.39,18.41 BILATERAL_COUPLING.1 40.26,18.41 37.59,18.41 v36.45,17.27
  Bottom 0.254: v35.56,15.11 35.56,17.27 v36.45,17.27
GND  (via drill 0.61)
  Top 0.254: 108.78,32.58 110.49,30.86 MICRO.5 | 108.78,32.58 105.41,35.94 R5_MICRO.1 | 102.62,8.64 104.14,8.64 MICRO_STATUS_LED.C 104.14,8.76 105.28,8.76 | 102.62,8.64 101.6,8.64 FPGA_STATUS_LED.C | 105.28,8.76 105.66,8.76 105.66,9.14 106.17,9.65 107.57,9.65 107.57,13.59 107.95,13.97 MICRO.12 | 81.28,1.78 78.74,1.78 | 78.74,1.78 77.47,1.78 C1_POWER.2 77.47,1.52 72.64,1.52 71.37,2.79 71.37,3.81 BATTERY.NEG | 78.74,1.78 3.3VREG.2 | 81.28,1.78 81.28,2.41 86.36,2.41 5VREG.1 86.49,2.54 86.49,5.71 | 81.28,1.78 C2_POWER.2 | 86.49,5.71 86.49,12.7 5VREG.4 | 90.74,5.65 90.68,5.71 86.49,5.71 | 90.74,5.65 93.85,2.54 5VREG.3 93.98,2.54 99.31,2.54 99.38,2.6 | FPGA.GND 95,16.26 95,9.91 90.74,5.65 | 102.62,8.64 102.62,5.84 99.38,2.6 | 108.78,32.58 105.28,29.08 105.28,8.76 | LED_THROUGHOLE.NEG 118.24,3.81 116.59,2.16 99.44,2.16 99.44,2.54 99.38,2.6 | OP_AMP1_DCOFF.2 32.77,24.13 32.77,27.69 | 32.77,27.69 32.77,31.75 31.94,32.58 | 31.94,32.58 31.88,32.64 30.73,32.64 VGA.11 | DAC.2 38.35,40.64 38.35,41.66 37.47,41.66 37.08,41.27 37.08,40.64 DAC.4 37.08,40.51 35.69,39.12 31.75,39.12 C4.2 | C4.2 31.75,38.48 30.73,37.47 30.73,34.04 VGA.9 | 32.83,36.51 31.37,37.97 C4.2 | 32.83,36.51 35.31,34.04 VGA.8 | 31.94,32.58 32.77,33.4 32.77,36.45 32.83,36.51 | 79.12,30.23 79.12,29.08 ADC.1 | 79.12,30.23 79.12,33.02 C1_ADC.2 | 76.58,27.05 76.58,27.43 77.22,28.07 77.22,28.96 ADC.4 77.22,29.08 77.22,30.23 79.12,30.23 | 76.58,27.05 76.58,21.84 ADC.16 | v73.91,27.56 73.91,28.96 ADC.9 | 76.58,27.05 v76.71,27.05 | 38.1,26.29 35.43,26.29 35.43,29.46 VGA.1 | OP_AMP_LPF.2 47.5,33.02 47.5,29.46 | 47.5,29.46 47.5,28.19 47.75,27.94 C2_LPF.2
  Top 0.254: v45.72,29.46 47.5,29.46 | v38.1,29.08 38.1,26.29 | 38.1,26.29 R4_DCOFF.2 | 24,27.69 32.77,27.69 | 24,27.69 24,28.83 FPGA.GND_6 | v54.74,16.51 OP_AMP_COUPLING.2 | 51.63,14.03 51.31,13.72 51.31,7.62 | 51.63,14.03 v52.96,15.37 | v41.15,13.72 40.39,14.48 BILATERAL_COUPLING.7 | RB_LPF.1 52.45,25.4 51.56,24.51 51.56,14.1 51.63,14.03 | 37.21,4.57 37.21,3.43 POT_COUPLING.CCW | 37.21,4.57 37.21,5.21 | 37.21,5.21 37.21,10.29 36.07,11.43 R1_COUPLING.2 | 25.65,6.35 OP_AMP2_DCOFF.2 | 25.65,4.57 25.65,3.05 26.16,2.54 R8_DCOFF.2 | 25.65,4.57 25.65,6.35 | 26.61,9.72 25.65,8.76 25.65,6.35 | 26.61,9.72 27.56,10.67 BILATERAL_DCOFF.7 | 20.51,15.81 17.78,13.08 D1_PROT.A | 20.51,15.81 22.86,18.16 R1_ATTEN.1 22.86,18.29 23.88,19.3 23.88,27.56 24,27.69 | 20.51,15.81 26.61,9.72 | 25.65,4.57 37.21,4.57 | 37.21,5.21 48.77,5.21 51.18,7.62 R4_COUPLING.2 51.31,7.62 | 51.31,7.62 v52.58,6.35
  Bottom 0.254: BATTERY.NEG 64.77,3.81 POT_ADC.CW 63.5,2.67 59.82,6.35 v52.58,6.35 | v76.71,27.05 74.42,27.05 v73.91,27.56 73.03,28.45 46.74,28.45 v45.72,29.46 38.1,29.46 | 38.1,29.46 24.51,29.46 24,28.96 FPGA.GND_6 | 38.1,29.46 v38.1,29.08 | v54.74,16.51 53.59,15.37 v52.96,15.37 47.88,15.37 46.86,14.35 41.78,14.35 v41.15,13.72 | D1_PROT.A 15.24,12.7 BNC.GND 7.11,19.05 7.11,36.07 VGA_R_INLO.CCW
LPF_OUT  (via drill 0.61)
  Top 0.254: 49.4,31.5 49.4,24.38 49.34,24.32 | 49.4,31.5 49.4,33.91 48.39,33.91 OP_AMP_LPF.1 | 49.34,24.32 47.88,22.86 C1_LPF.2 | v52.45,22.86 52.45,21.59 RA_LPF.2 | v49.4,24.26 49.34,24.32 | v33.66,31.5 35.31,31.5 VGA.4 | 49.4,31.5 v49.53,31.5
  Bottom 0.254: v52.45,22.86 51.05,24.26 v49.4,24.26 | v49.53,31.5 v33.66,31.5
N$1
  Top 0.254: 3.3VREG.5 77.72,10.29 75.95,10.29 75.95,11.43 L1_POWER.1
N$2  (via drill 0.61)
  Top 0.254: 46.23,27.05 48.64,27.05 48.9,27.3 48.9,28.57 48.64,28.83 48.64,31.75 48.39,32 OP_AMP_LPF.3 | 46.23,27.05 46.23,27.94 C2_LPF.1 | v42.8,26.67 42.8,27.94 R2_LPF.2 | 46.23,27.05 v45.85,26.67
  Bottom 0.254: v45.85,26.67 v42.8,26.67
N$3  (via drill 0.61)
  Top 0.254: v33.4,38.23 37.97,33.66 37.97,32.13 35.43,32.13 VGA.5
  Bottom 0.254: v33.4,38.23 30.86,40.77 10.29,40.77 VGA_R_INLO.W
N$4  (via drill 0.61)
  Top 0.254: 42.1,23.43 41.15,24.38 41.15,27.94 R2_LPF.1 | 42.1,23.43 42.67,22.86 R1_LPF.2 | v45.72,24.13 45.72,23.24 46.1,22.86 C1_LPF.1 | 42.1,23.43 v42.8,24.13
  Bottom 0.254: v42.8,24.13 v45.72,24.13
N$5
  Top 0.254: OP_AMP_LPF.4 50.8,32 51.69,31.11 51.69,27.81 54.1,25.4 RB_LPF.2 54.23,25.4 54.23,21.59 RA_LPF.1
N$6
  Top 0.254: C1_ADC.1 80.77,33.02 79.76,32 79.76,28.07 79.5,27.81 78.49,27.81 78.49,28.96 ADC.2
N$7  (via drill 0.61)
  Top 0.254: v55.12,14.48 55.12,14.73 55.88,15.49 OP_AMP_COUPLING.3 | 47.88,11.43 v47.88,13.21 | 47.88,11.43 47.88,7.62 R3_COUPLING.2 | 47.88,11.43 R2_COUPLING.2
  Bottom 0.254: v55.12,14.48 53.85,13.21 v47.88,13.21
N$8  (via drill 0.61)
  Top 0.254: ADC.6 75.82,29.08 75.82,30.86 D1_ADC.C D2_ADC.A | POT_ADC.W 65.41,12.06 65.41,22.61 v72.14,29.34
  Bottom 0.254: v72.14,29.34 74.55,31.75 D1_ADC.C
N$9
  Top 0.254: OP_AMP_COUPLING.4 58.29,15.49 56.77,13.97 56.77,11.43 R5_COUPLING.1 56.64,11.43 56.64,11.3 52.96,7.62 R4_COUPLING.1
N$10
  Top 0.254: R2_COUPLING.1 C1_COUPLING.2
N$11
  Top 0.254: FPGA.PIN_97 69.85,37.97 83.57,37.97 96.65,24.89 96.65,10.92 99.06,8.51 R1_FPGA.1
N$12  (via drill 0.61)
  Top 0.254: R4_DCOFF.1 38.1,23.24 v35.43,23.24 34.29,23.24 OP_AMP1_DCOFF.4 | v29.21,23.24 26.67,23.24 R3_DCOFF.1
  Bottom 0.254: v35.43,23.24 v29.21,23.24
N$13  (via drill 0.61)
  Top 0.254: OP_AMP1_DCOFF.3 31.75,23.11 31.37,22.73 v31.37,20.32 31.37,19.05 R2_DCOFF.2 | v33.66,20.07 34.67,19.05 R1_DCOFF.2
  Bottom 0.254: v33.66,20.07 33.4,20.32 v31.37,20.32
N$14  (via drill 0.61)
  Top 0.254: 30.1,25.02 26.67,25.02 R3_DCOFF.2 | 30.1,25.02 31.75,25.02 OP_AMP1_DCOFF.1 | BILATERAL_DCOFF.11 31.88,12.7 v31.88,17.02 | 30.1,25.02 v30.1,20.32
  Bottom 0.254: v31.88,17.02 31.88,19.43 30.99,19.43 v30.1,20.32
N$15
  Top 0.254: R8_DCOFF.1 24.51,2.54 24.51,5.08 24.26,5.33 OP_AMP2_DCOFF.3 24.13,5.46 20.32,5.46 R6_DCOFF.2
N$16
  Top 0.254: 30.48,5.46 26.67,5.46 OP_AMP2_DCOFF.4 | 30.48,5.46 34.29,5.46 R5_DCOFF.2 | 30.48,5.46 R7_DCOFF.1
N$17  (via drill 0.61)
  Top 0.254: v24.77,8.38 24.77,7.87 24.26,7.37 OP_AMP2_DCOFF.1 | 30.48,7.49 v29.21,7.49 | 30.48,7.49 R7_DCOFF.2 30.48,7.24 | 30.48,7.49 30.48,7.87 33.27,10.67 BILATERAL_DCOFF.8
  Bottom 0.254: v24.77,8.38 25.65,7.49 v29.21,7.49
N$18
  Top 0.254: FPGA_STATUS_LED.A 101.6,6.73 99.06,6.73 R1_FPGA.2
N$19  (via drill 0.61)
  Top 0.254: v26.29,13.59 26.29,13.97 27.56,13.97 BILATERAL_DCOFF.2 | v21.08,8.38 20.32,7.62 R6_DCOFF.1
  Bottom 0.254: v21.08,8.38 v26.29,13.59
N$20  (via drill 0.61)
  Top 0.254: v108.46,12.32 108.46,8.51 106.68,8.51 R3_MICRO.2
  Bottom 0.254: v108.46,12.32 108.71,12.57 111.63,12.57 113.03,13.97 MICRO.14
N$21
  Top 0.254: MICRO_STATUS_LED.A 104.14,6.73 106.68,6.73 R3_MICRO.1
N$22  (via drill 0.61)
  Top 0.254: 29.59,19.05 29.59,13.46 27.69,13.46 BILATERAL_DCOFF.3 | MICRO.9 104.27,22.99 104.27,36.45 105.41,37.59 R5_MICRO.2 105.41,37.72 v108.46,40.77 | 29.59,19.05 28.57,20.07 v28.57,22.1 | 29.59,19.05 R2_DCOFF.1
  Bottom 0.254: v28.57,22.1 28.96,21.72 102.74,21.72 MICRO.9 | PAIRING_SWITCH.NEG 120.52,40.77 v108.46,40.77
N$23  (via drill 0.61)
  Top 0.254: v108.33,26.67 108.33,25.4 R4_MICRO.2
  Bottom 0.254: MICRO.7 v108.33,26.67
N$24
  Top 0.254: LED_THROUGHOLE.POS 122.05,9.02 122.05,15.37 120.14,15.37 110.11,25.4 R4_MICRO.1
N$25  (via drill 0.61)
  Top 0.254: v35.43,40.13 31.75,40.13 C4.1 | v39.75,39.37 37.85,39.37 37.85,40.51 DAC.3
  Bottom 0.254: v35.43,40.13 36.2,39.37 v39.75,39.37
N$26
  Top 0.254: BYPASS_ATTEN_MICRO.2 101.6,22.86 MICRO.8
N$27  (via drill 0.61)
  Top 0.254: v53.09,30.86 54.61,30.86 R_ENBL_VGA.2 | v37.08,30.61 36.7,30.23 35.43,30.23 VGA.2
  Bottom 0.254: v53.09,30.86 52.83,30.61 v37.08,30.61
N$28  (via drill 0.61)
  Top 0.254: OP_AMP_LPF.5 52.2,33.02 52.2,30.48 v57.02,25.65 | v62.23,23.37 60.96,22.1 R_EN_LPF.1
  Bottom 0.254: v57.02,25.65 59.31,23.37 v62.23,23.37
NEG_OFFSET_EN  (via drill 0.61)
  Top 0.254: OP_AMP2_DCOFF.5 28.32,6.35 28.32,10.29 28.45,10.41 28.45,11.18 28.38,11.24 | 28.38,11.24 28.32,11.3 27.69,11.3 BILATERAL_DCOFF.6 | v34.67,13.97 33.4,13.97 BILATERAL_DCOFF.13 | v31.24,11.3 28.45,11.3 28.38,11.24 | v98.93,12.57 MICRO.11
  Bottom 0.254: 33.08,12.38 32,11.3 v31.24,11.3 | 33.08,12.38 v34.67,13.97 | v98.93,12.57 48.51,12.57 48.26,12.32 33.15,12.32 33.08,12.38
NET_IO_1
  Top 0.254: BILATERAL_DCOFF.4 25.4,12.7 25.4,16.89 25.46,16.95 | 25.46,16.95 26.67,18.16 R_OFFSET_BYPASS.2 | BILATERAL_DCOFF.1 27.56,14.73 25.53,16.76 25.53,16.89 25.46,16.95
OFST  (via drill 0.61)
  Top 0.254: v42.93,7.62 R3_COUPLING.1
  Bottom 0.254: POT_COUPLING.W v42.93,7.62
POS_OFFSET
  Top 0.254: BILATERAL_COUPLING.10 45.97,15.88 43.31,15.88 43.31,18.41 43.05,18.67 43.05,21.46 43.69,22.1 43.69,28.7 43.43,28.96 39.12,28.96 39.12,21.72 36.45,19.05 R1_DCOFF.1
POS_OFFSET_EN  (via drill 0.61)
  Top 0.254: OP_AMP1_DCOFF.5 33.27,24.13 33.27,20.95 32.77,20.45 v32.77,19.05 32.77,17.91 | 32.77,17.91 32.77,15.24 32.51,14.99 32.51,13.59 32.64,13.46 33.27,13.46 BILATERAL_DCOFF.12 | 32.77,17.91 31.5,17.91 30.73,17.14 30.73,12.06 27.69,12.06 BILATERAL_DCOFF.5 | v43.94,19.05 43.94,17.14 45.97,17.14 BILATERAL_COUPLING.12
  Bottom 0.254: v32.77,19.05 v43.94,19.05 44.32,19.43 102.49,19.43 MICRO.10
PROBE_OUT
  Top 0.254: R2_ATTEN.2 22.86,25.02 17.78,30.1 D1_PROT.C BNC.S
RESET
  Bottom 0.254: FPGA.PIN_98 69.85,36.83 82.17,36.83 94.87,24.13 97.79,24.13 101.73,28.07 106.55,28.07 107.06,27.56 108.71,27.56 120.9,15.37 121.79,15.37 122.05,15.11 122.05,12.57 116.97,12.57 115.57,13.97 MICRO.15
SCL  (via drill 0.61)
  Top 0.254: 92.77,20.77 92.71,20.7 FPGA.PIN_50 v92.71,14.22 | 92.77,20.77 93.98,21.97 R2_MICRO.1 | v53.34,40.51 39.12,40.51 DAC.1 | 92.77,20.77 v90.93,22.61 | v109.35,11.43 109.35,12.83 110.49,13.97 MICRO.13
  Bottom 0.254: v53.34,40.51 60.83,33.02 80.52,33.02 v90.93,22.61 | v109.35,11.43 101.35,11.43 98.55,14.22 v92.71,14.22
SDA  (via drill 0.61)
  Top 0.254: FPGA.PIN_49 90.17,20.7 88.9,21.97 R1_MICRO.1 | v49.78,38.23 39.12,38.23 DAC.8 | v82.17,33.53 86.49,29.21 v86.49,18.54
  Bottom 0.254: v49.78,38.23 52.96,41.4 62.74,41.4 70.61,33.53 v82.17,33.53 | v86.49,18.54 87.12,17.91 88.77,17.91 FPGA.PIN_49 91.57,15.11 104.01,15.11 104.27,15.37 116.84,15.37 118.11,14.1 MICRO.16
VCC  (via drill 0.61)
  Top 0.254: 33.91,28.57 33.91,30.48 34.16,30.73 35.31,30.73 VGA.3 | 33.91,28.57 33.91,25.4 34.16,25.15 OP_AMP1_DCOFF.6 | 31.88,29.59 32.13,29.59 32.13,30.48 31.88,30.73 30.73,30.73 VGA.14 30.61,30.86 25.91,30.86 25.91,35.31 20.45,40.77 3.94,40.77 3.94,36.96 VGA_R_INLO.CW | 31.88,29.59 30.73,29.59 VGA.16 | v33.66,28.57 33.91,28.57 | 31.88,29.59 v31.88,28.57 | v34.67,17.14 34.67,16 33.4,14.73 BILATERAL_DCOFF.14 | v44.83,18.16 45.21,18.16 45.4,18.35 | 45.4,18.35 45.47,18.41 45.97,18.41 BILATERAL_COUPLING.14 | 54.61,33.91 50.8,33.91 OP_AMP_LPF.6 50.67,34.04 50.67,35.05 44.2,35.05 | 54.61,33.91 R_ENBL_VGA.1 54.61,32.51 57.91,29.21 57.91,20.45 59.56,18.8 | 54.61,33.91 R_MODE_VGA.1 | 40.7,35.12 40.77,35.05 44.2,35.05 | 40.7,35.12 38.48,37.34 38.48,38.1 DAC.7 | 45.4,18.35 44.83,18.92 44.83,21.72 44.2,22.35 44.2,35.05 | 93.98,23.75 88.9,23.75 | 75.82,27.81 76.2,27.81 76.58,28.19 76.58,28.96 ADC.5 76.58,29.08 76.58,34.42 82.55,34.42 87,29.97 87,25.65 88.9,23.75 | 75.82,27.81 74.93,27.81 74.55,28.19 74.55,28.96 ADC.8 | 75.82,27.81 75.82,22.99 | 75.82,22.99 75.82,21.84 ADC.15 | 88.9,23.75 R1_MICRO.2 | 80.39,9.14 80.39,9.53 79.76,10.16 3.3VREG.4 | 80.39,9.14 80.39,4.32 81.28,3.43 C2_POWER.1 | 80.39,9.14 76.07,9.14 75.06,10.16 75.06,10.41 74.04,11.43 L1_POWER.2 73.91,11.43 68.71,6.22 65.91,6.22 | 59.56,18.8 59.56,20.32 59.94,20.7 59.94,22.61 60.96,23.62 R_EN_LPF.2 | 59.56,18.8 59.56,18.67 58.42,17.53 OP_AMP_COUPLING.6 58.67,17.65 59.18,17.14 59.18,6.22 | v27.43,8.38 27.43,8.13 26.67,7.37 OP_AMP2_DCOFF.6 | POT_COUPLING.CW POT_ADC.CCW 59.18,3.3 59.18,6.22 | 59.18,6.22 65.91,6.22 | 75.82,22.99 66.55,22.99 66.55,18.29 65.91,17.65 65.91,6.22
  Top 0.254: 93.98,23.75 v95.25,25.02 | 93.98,23.75 R2_MICRO.2 | v36.32,28.57 40.64,32.89 40.64,35.05 40.7,35.12
  Bottom 0.254: v31.88,28.57 v33.66,28.57 v36.32,28.57 | v34.67,17.14 35.69,18.16 v44.83,18.16 | PAIRING_SWITCH.POS 122.05,34.29 122.05,28.07 121.79,27.81 109.22,27.81 107.95,29.08 MICRO.6 107.95,28.96 107.57,28.57 98.81,28.57 v95.25,25.02 | v27.43,8.38 37.34,8.38 POT_COUPLING.CW
VGA_MODE  (via drill 0.61)
  Top 0.254: v50.42,35.94 54.61,40.13 R_MODE_VGA.2 | v37.08,33.27 36.58,32.77 35.43,32.77 VGA.6
  Bottom 0.254: v50.42,35.94 47.75,33.27 v37.08,33.27
VGA_OUT  (via drill 0.61)
  Top 0.254: v55.88,33.02 VGA_TO_ADC.1 | v28.96,32.38 29.21,32.13 29.21,31.75 29.46,31.5 30.61,31.5 VGA.13
  Bottom 0.254: v55.88,33.02 55.24,32.38 v28.96,32.38
VGA_VDBS  (via drill 0.61)
  Top 0.254: v37.72,35.94 37.72,38.1 DAC.6 | v33.66,33.91 34.16,33.4 35.31,33.4 VGA.7
  Bottom 0.254: v37.72,35.94 35.69,33.91 v33.66,33.91